# Altium schematic sheet Ethernet.SchDoc
size 420 x 297 mm; Address1: Address1; Address2: Address2; Address3: Address3; Address4: Address4; DocumentNumber: *Э3; SheetNumber: 10; SheetTotal: 11; DocumentType: Схема электрическая *
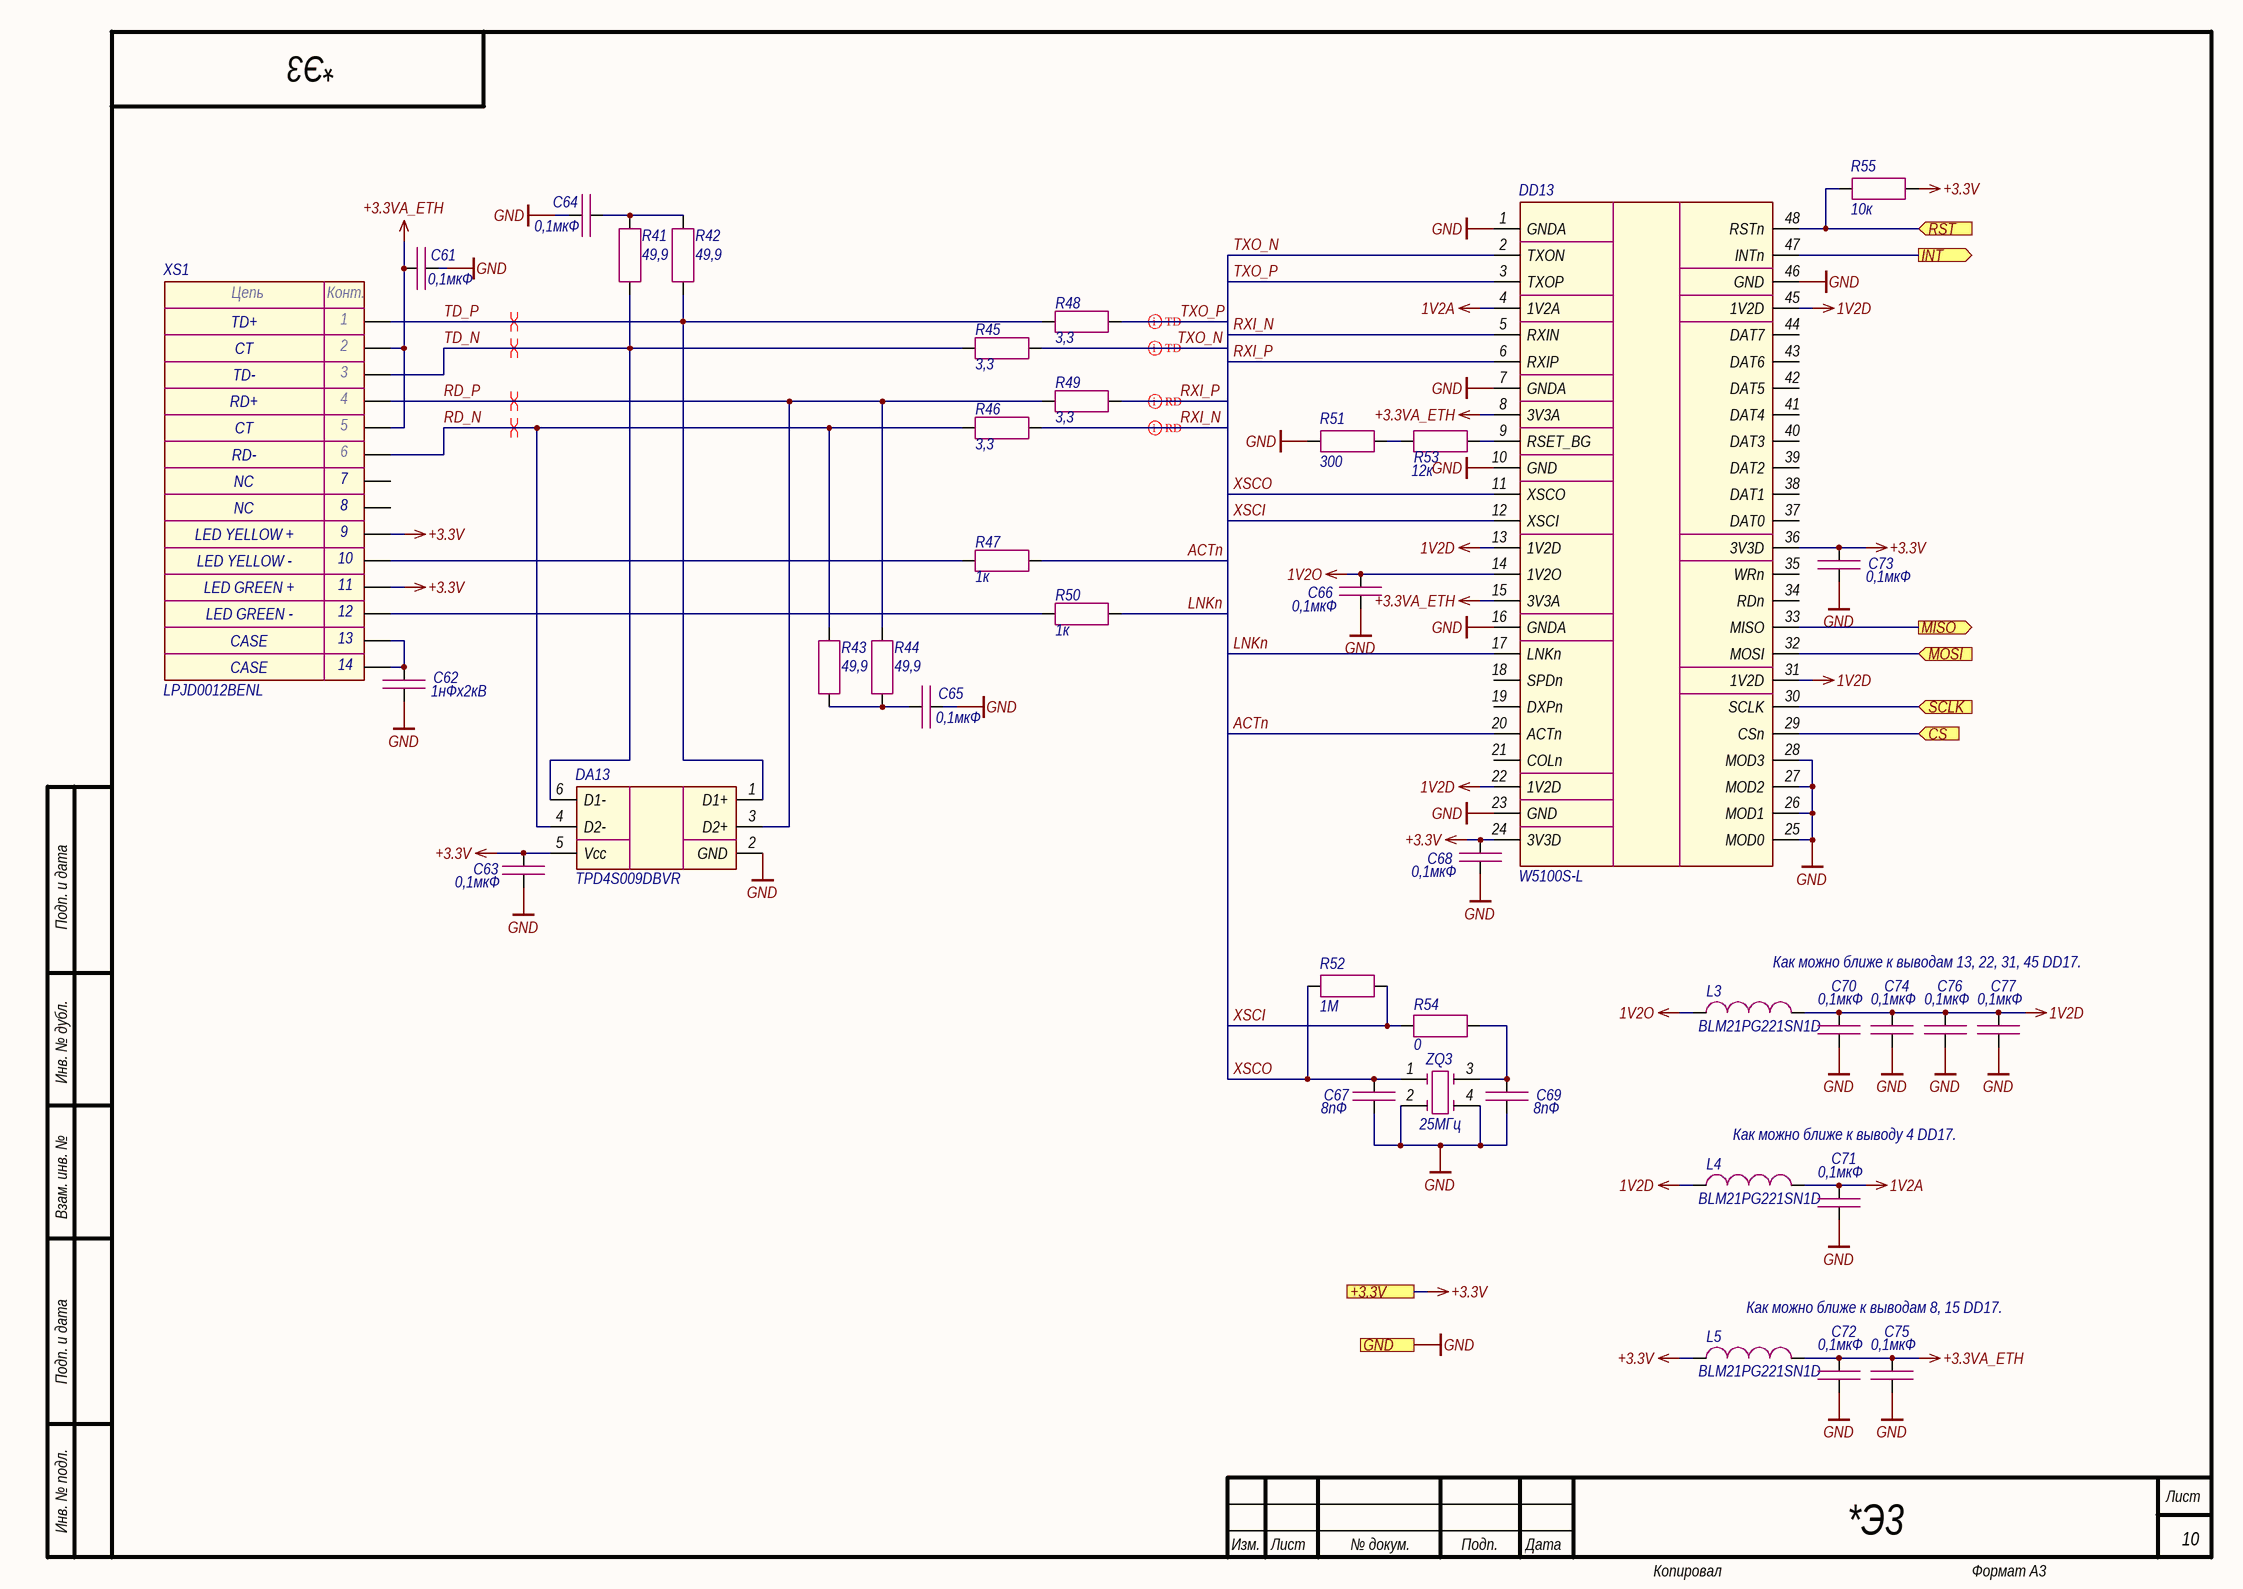
[diagram p0: Ethernet.SchDoc]

## Parts
C61  0,1мкФ  [CAP_0603]
C62  1нФх2кВ  [CAP_1206]
C63  0,1мкФ  [CAP_0603]
C64  0,1мкФ  [CAP_0603]
C65  0,1мкФ  [CAP_0603]
C66  0,1мкФ  [CAP_0603]
C67  8пФ  [CAP_0603]
C68  0,1мкФ  [CAP_0603]
C69  8пФ  [CAP_0603]
C70  0,1мкФ  [CAP_0603]
C71  0,1мкФ  [CAP_0603]
C72  0,1мкФ  [CAP_0603]
C73  0,1мкФ  [CAP_0603]
C74  0,1мкФ  [CAP_0603]
C75  0,1мкФ  [CAP_0603]
C76  0,1мкФ  [CAP_0603]
C77  0,1мкФ  [CAP_0603]
DA13  TPD4S009DBVR  [SOT-23-6]
DD13  W5100S-L  [LQFP-48]
L3  BLM21PG221SN1D  [IND_0805]
L4  BLM21PG221SN1D  [IND_0805]
L5  BLM21PG221SN1D  [IND_0805]
R41  49,9  [RES_0603]
R42  49,9  [RES_0603]
R43  49,9  [RES_0603]
R44  49,9  [RES_0603]
R45  3,3  [RES_0603]
R46  3,3  [RES_0603]
R47  1к  [RES_0603]
R48  3,3  [RES_0603]
R49  3,3  [RES_0603]
R50  1к  [RES_0603]
R51  300  [RES_0603]
R52  1М  [RES_0603]
R53  12к  [RES_0603]
R54  0  [RES_0603]
R55  10к  [RES_0603]
XS1  LPJD0012BENL  [LPJD0012BENL]
ZQ3  25МГц  [7M]

## Ports
+3.3V (see Main[2B], Fiber_interlock[2C], Hardwiring[3D], LD_driver[1D], Power_supply[2D], Protection[2C]), CS (in, see Main[2B]), GND (see Main[2B], Fiber_interlock[2C], Guide_laser[1C], Hardwiring[3D], Indication[1C], LD_driver[1D], Power_supply[2D], Protection[2C]), INT (out, see Main[2B]), MISO (out, see Main[2B]), MOSI (in, see Main[2B]), RST (in, see Main[2B]), SCLK (in, see Main[2B])

## Nets
1V2A: C71.1 DD13.4(1V2A) L4.2
1V2D: C70.1 C74.1 C76.1 C77.1 DD13.13(1V2D) DD13.22(1V2D) DD13.31(1V2D) DD13.45(1V2D) L3.2 L4.1
1V2O: C66.1 DD13.14(1V2O) L3.1
+3.3V: C63.1 C68.1 C73.1 DA13.5(Vcc) DD13.24(3V3D) DD13.36(3V3D) L5.1 R55.2 XS1.9 XS1.11 ; port +3.3V
+3.3VA_ETH: C61.1 C72.1 C75.1 DD13.8(3V3A) DD13.15(3V3A) L5.2 XS1.2 XS1.5
GND: C61.2 C62.2 C63.2 C64.2 C65.2 C66.2 C67.2 C68.2 C69.2 C70.2 C71.2 C72.2 C73.2 C74.2 C75.2 C76.2 C77.2 DA13.2(GND) DD13.1(GNDA) DD13.7(GNDA) DD13.10(GND) DD13.16(GNDA) DD13.23(GND) DD13.25(MOD0) DD13.26(MOD1) DD13.27(MOD2) DD13.28(MOD3) DD13.46(GND) R51.1 ZQ3.2 ZQ3.4 ; port GND
ACTn: DD13.20(ACTn) R47.2
CS: DD13.29(CSn) ; port CS
INT: DD13.47(INTn) ; port INT
LNKn: DD13.17(LNKn) R50.2
MISO: DD13.33(MISO) ; port MISO
MOSI: DD13.32(MOSI) ; port MOSI
RD_N: DA13.4(D2-) R43.1 R46.2 XS1.6
RD_P: DA13.3(D2+) R44.1 R49.2 XS1.4
RST: DD13.48(RSTn) R55.1 ; port RST
RXI_N: DD13.5(RXIN) R46.1
RXI_P: DD13.6(RXIP) R49.1
SCLK: DD13.30(SCLK) ; port SCLK
TD_N: DA13.6(D1-) R41.1 R45.2 XS1.3
TD_P: DA13.1(D1+) R42.1 R48.2 XS1.1
TXO_N: DD13.2(TXON) R45.1
TXO_P: DD13.3(TXOP) R48.1
XSCI: DD13.12(XSCI) R52.2 R54.1
XSCO: C67.1 DD13.11(XSCO) R52.1 ZQ3.1
NetC62_1: C62.1 XS1.13 XS1.14
NetC64_1: C64.1 R41.2 R42.2
NetC65_1: C65.1 R43.2 R44.2
NetC69_1: C69.1 R54.2 ZQ3.3
NetDD13_9: DD13.9(RSET_BG) R53.2
NetR47_1: R47.1 XS1.10
NetR50_1: R50.1 XS1.12
NetR51_2: R51.2 R53.1

Not connected (* = marked no-connect by the designer): DD13 18(SPDn) 19(DXPn) 21(COLn) 34(RDn) 35(WRn) 37(DAT0) 38(DAT1) 39(DAT2) 40(DAT3) 41(DAT4) 42(DAT5) 43(DAT6) 44(DAT7); XS1 7 8

## Layout directives
differential pair; differential pair class TD: TXO_N, TXO_P
differential pair; differential pair class RD: RXI_N, RXI_P
differential pair: RD_N, RD_P, TD_N, TD_P

## Notes on the sheet
- Как можно ближе к выводам 13, 22, 31, 45 DD17.
- Как можно ближе к выводу 4 DD17.
- Как можно ближе к выводам 8, 15 DD17.
- Подп. и дата
- Инв. № дубл.
- Взам. инв. №
- Инв. № подл.
- Изм.
- Лист
- № докум.
- Подп.
- Дата
- Копировал
- Формат А3
- (in symbol LPJD0012BENL) Цепь; Конт.; TD+; CT; TD-; RD+; RD-; NC; LED YELLOW +; LED YELLOW -; LED GREEN +; LED GREEN -; CASE

## Library data of the parts
C61 C63-C66 C68 C70-C77 = Capacitor: Manufacturer: Murata; Model: GRM188R71H104KA93D; Value: 0,1мкФ; Document: *
C62 = Capacitor: Manufacturer: Yageo; Model: CC1206KKX7RDBB102; Value: 1нФх2кВ; Document: *
C67 C69 = Capacitor: Manufacturer: Yageo; Model: CC0603CRNPO9BN8R0; Value: 8пФ; Document: *
DA13 = TPD4S009: Manufacturer: Texas Instruments; Model: TPD4S009DBVR; Document: *
DD13 = W5100S: Manufacturer: Wiznet; Model: W5100S-L; Document: *
L3-L5 = Inductor: Manufacturer: Murata; Value: *; Model: BLM21PG221SN1D; Document: *
R41-R44 = Resistor: Manufacturer: Yageo; Model: RC0603FR-0749R9L; Value: 49,9; Document: *
R45 R46 R48 R49 = Resistor: Manufacturer: Yageo; Model: RC0603FR-073R3L; Value: 3,3; Document: *
R47 R50 = Resistor: Manufacturer: Yageo; Model: RC0603FR-071KL; Value: 1к; Document: *
R51 = Resistor: Manufacturer: Yageo; Model: RC0603FR-07300RL; Value: 300; Document: *
R52 = Resistor: Manufacturer: Yageo; Model: RC0603FR-071ML; Value: 1М; Document: *
R53 = Resistor: Manufacturer: Yageo; Model: RC0603FR-0712KL; Value: 12к; Document: *
R54 = Resistor: Manufacturer: Yageo; Model: RC0603JR-070RL; Value: 0; Document: *
R55 = Resistor: Manufacturer: Yageo; Model: RC0603FR-0710KL; Value: 10к; Document: *
XS1 = LPJD0012BENL: Manufacturer: LINK-PP; Model: LPJD0012BENL; Document: *
ZQ3 = Quartz_Resonator_4-pin: Manufacturer: TXC; Model: 7M-25.000MAAJ-T; Value: 25МГц; Document: *